# EAGLE schematic porcupine5v1_4 (EAGLE 6.5.0)
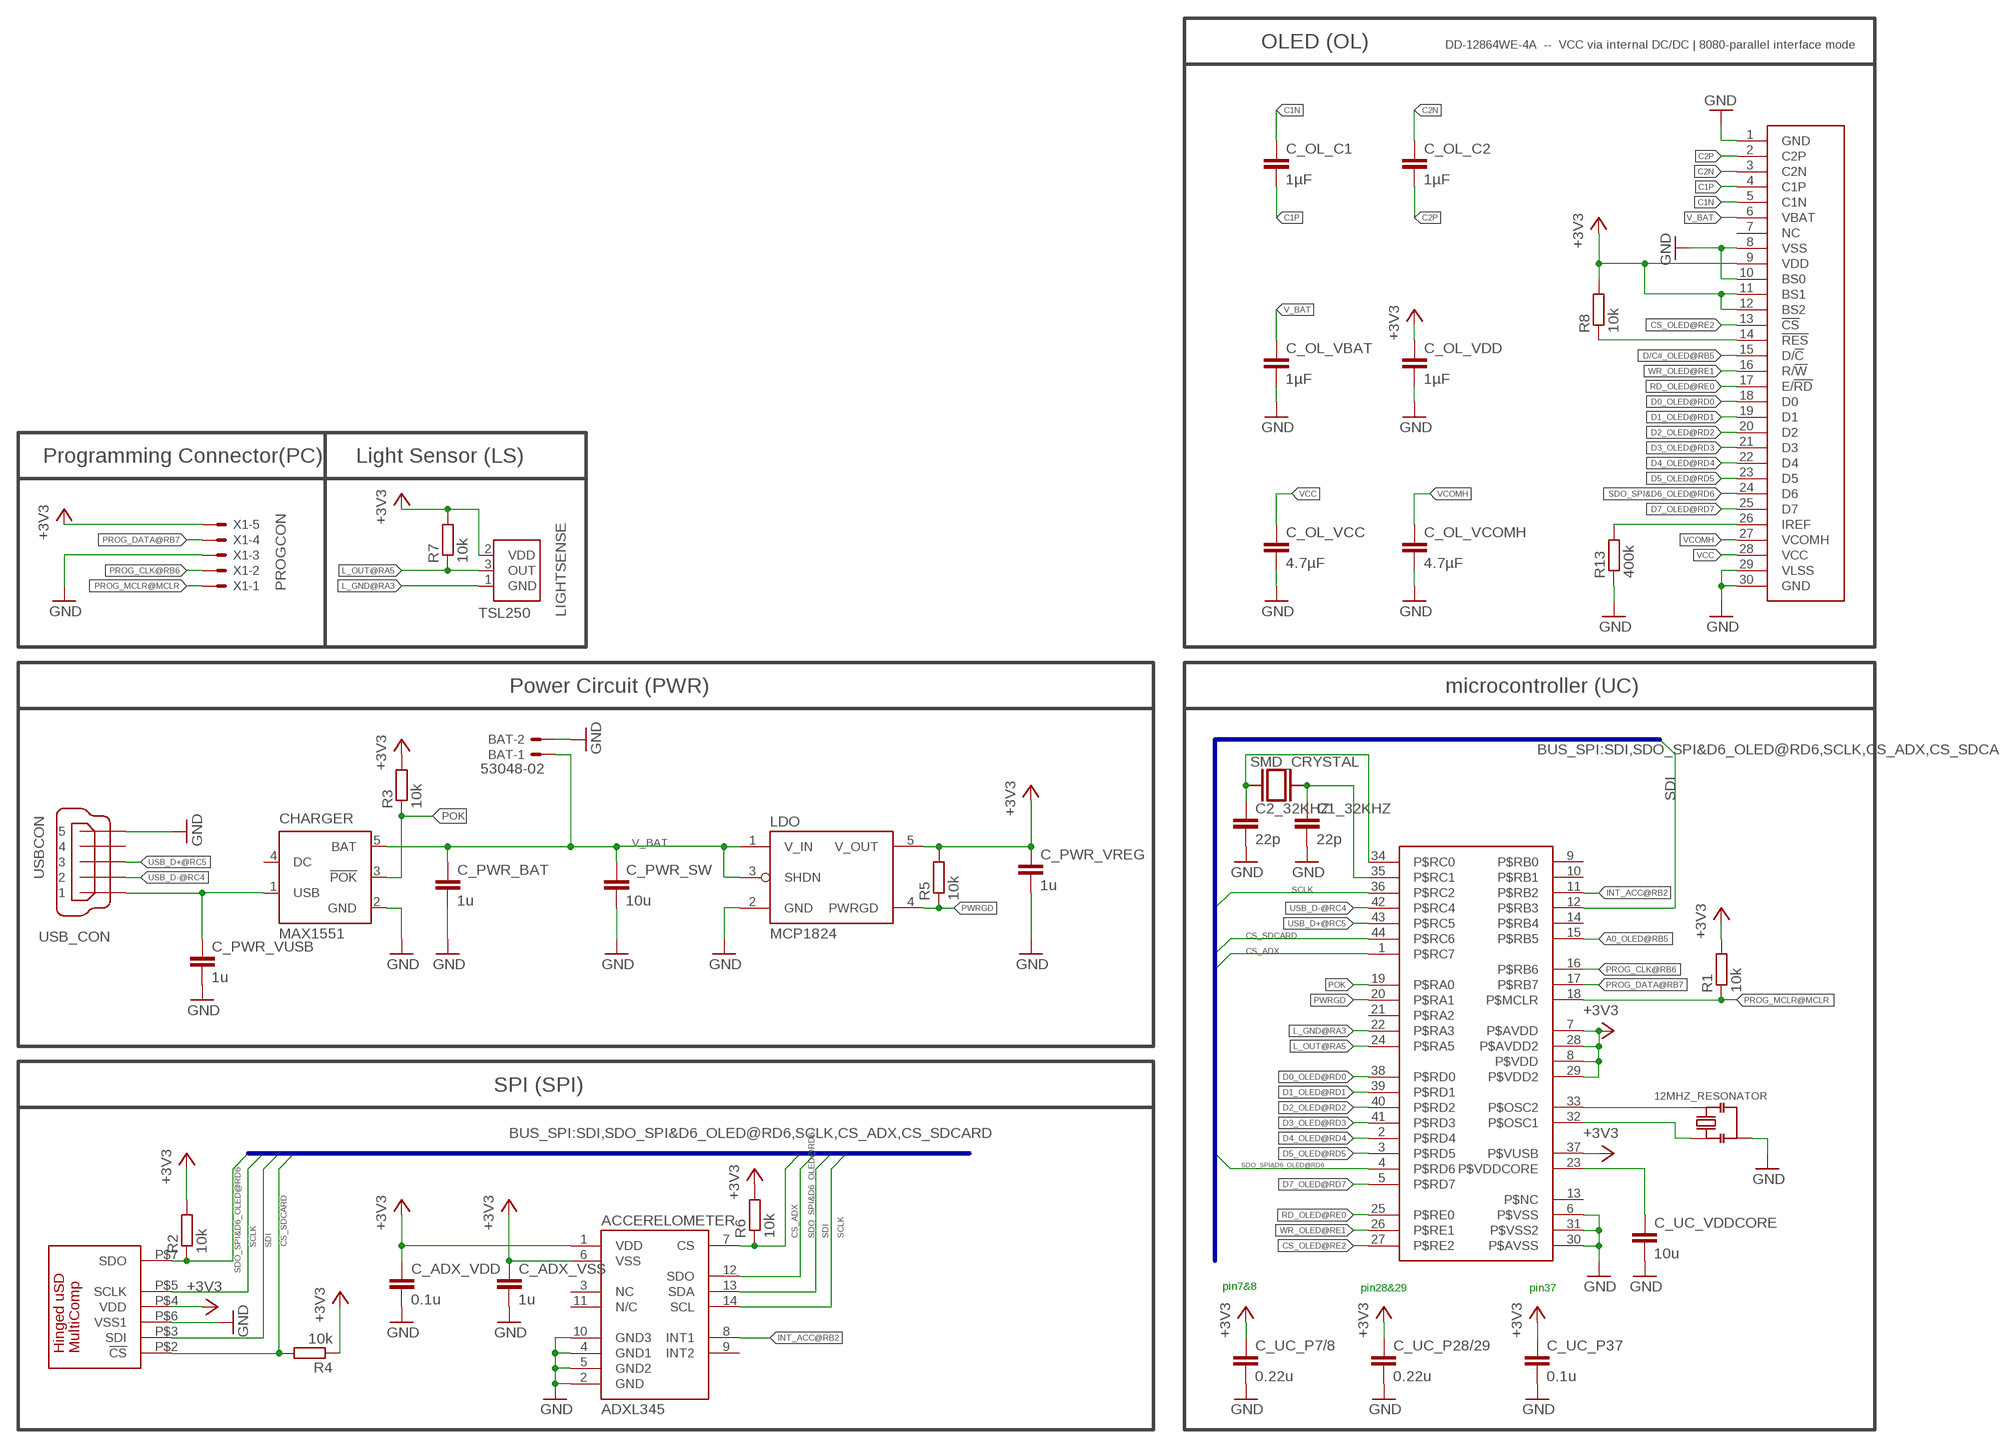
[diagram p0: schematic, sheet 1]

## Parts
12MHZ_RESONATOR  RESONATORPRQC-C  [PRQC-C]
ACCERELOMETER  ADXL345  [LGA14]
BAT  53048-02  [53048-02]
C1_32KHZ  22p  C-EUC0603K  [C0603K]
C2_32KHZ  22p  C-EUC0603K  [C0603K]
C_ADX_VDD  0.1u  C-EUC0603K  [C0603K]
C_ADX_VSS  1u  C-EUC0603K  [C0603K]
C_OL_C1  1µF  C-EUC0603K  [C0603K]
C_OL_C2  1µF  C-EUC0603K  [C0603K]
C_OL_VBAT  1µF  C-EUC0603K  [C0603K]
C_OL_VCC  4.7µF  C-EUC0603K  [C0603K]
C_OL_VCOMH  4.7µF  C-EUC0603K  [C0603K]
C_OL_VDD  1µF  C-EUC0603K  [C0603K]
C_PWR_BAT  1u  C-EUC0603K  [C0603K]
C_PWR_SW  10u  C-EUC0805K  [C0805K]
C_PWR_VREG  1u  C-EUC0603K  [C0603K]
C_PWR_VUSB  1u  C-EUC0603K  [C0603K]
C_UC_P7/8  0.22u  C-EUC0603K  [C0603K]
C_UC_P28/29  0.22u  C-EUC0603K  [C0603K]
C_UC_P37  0.1u  C-EUC0603K  [C0603K]
C_UC_VDDCORE  10u  C-EUC0805K  [C0805K]
CHARGER  MAX1551  [SOT23-5L]
LDO  MCP1824  [SOT-23-5]
LIGHTSENSE  TSL250  [TSL]
PIC_CONTROLLER  PIC_P2V6  [QFN44ML8X8]
R1  10k  R-EU_R0603  [R0603]
R2  10k  R-EU_R0603  [R0603]
R3  10k  R-EU_R0603  [R0603]
R4  10k  R-EU_R0603  [R0603]
R5  10k  R-EU_R0603  [R0603]
R6  10k  R-EU_R0603  [R0603]
R7  10k  R-EU_R0603  [R0603]
R8  10k  R-EU_R0603  [R0603]
R13  400k  R-EU_R0603  [R0603]
SDCARD_CON  MICROSD_CONN  [460DA40013]
SMD_CRYSTAL  SMD_CRYSTAL  [SMD_CRYSTAL]
U$1  DD-12864WE-4A  [CON_DD-12864WE-4A]
USB_CON  USBCON  [248601]
X1  PROGCON  [53047-05-OCT]

## Nets
+3V3: ACCERELOMETER.1(VDD) ACCERELOMETER.6(VSS) C_ADX_VDD.1 C_ADX_VSS.1 C_OL_VDD.1 C_PWR_VREG.1 C_UC_P7/8.1 C_UC_P28/29.1 C_UC_P37.1 LDO.5(V_OUT) LIGHTSENSE.2(VDD) PIC_CONTROLLER.7(P$AVDD) PIC_CONTROLLER.8(P$VDD) PIC_CONTROLLER.28(P$AVDD2) PIC_CONTROLLER.29(P$VDD2) PIC_CONTROLLER.37(P$VUSB) R1.2 R2.2 R3.2 R4.1 R5.2 R6.2 R7.2 R8.2 SDCARD_CON.P$4(VDD) U$1.9(VDD) U$1.11(BS1) U$1.12(BS2) X1.5
A0_OLED@RB5: PIC_CONTROLLER.15(P$RB5)
C1N: C_OL_C1.1 U$1.5(C1N)
C1P: C_OL_C1.2 U$1.4(C1P)
C2N: C_OL_C2.1 U$1.3(C2N)
C2P: C_OL_C2.2 U$1.2(C2P)
CS_ADX: ACCERELOMETER.7(CS) PIC_CONTROLLER.1(P$RC7) R6.1
CS_OLED@RE2: PIC_CONTROLLER.27(P$RE2) U$1.13(!CS)
CS_SDCARD: PIC_CONTROLLER.44(P$RC6) R4.2 SDCARD_CON.P$2(!CS)
D0_OLED@RD0: PIC_CONTROLLER.38(P$RD0) U$1.18(D0)
D1_OLED@RD1: PIC_CONTROLLER.39(P$RD1) U$1.19(D1)
D2_OLED@RD2: PIC_CONTROLLER.40(P$RD2) U$1.20(D2)
D3_OLED@RD3: PIC_CONTROLLER.41(P$RD3) U$1.21(D3)
D4_OLED@RD4: PIC_CONTROLLER.2(P$RD4) U$1.22(D4)
D5_OLED@RD5: PIC_CONTROLLER.3(P$RD5) U$1.23(D5)
D7_OLED@RD7: PIC_CONTROLLER.5(P$RD7) R13.2 U$1.25(D7) U$1.26(IREF)
D/C#_OLED@RB5: U$1.15(D/!C)
GND: 12MHZ_RESONATOR.2_GND(GND) ACCERELOMETER.2(GND) ACCERELOMETER.4(GND1) ACCERELOMETER.5(GND2) ACCERELOMETER.10(GND3) BAT.2 C1_32KHZ.2 C2_32KHZ.2 C_ADX_VDD.2 C_ADX_VSS.2 C_OL_VBAT.2 C_OL_VCC.2 C_OL_VCOMH.2 C_OL_VDD.2 C_PWR_BAT.2 C_PWR_SW.2 C_PWR_VREG.2 C_PWR_VUSB.2 C_UC_P7/8.2 C_UC_P28/29.2 C_UC_P37.2 C_UC_VDDCORE.2 CHARGER.2(GND) LDO.2(GND) PIC_CONTROLLER.6(P$VSS) PIC_CONTROLLER.30(P$AVSS) PIC_CONTROLLER.31(P$VSS2) R13.1 SDCARD_CON.P$6(VSS1) U$1.1(GND) U$1.8(VSS) U$1.10(BS0) U$1.29(VLSS) U$1.30(GND) USB_CON.5 X1.3
INT_ACC@RB2: ACCERELOMETER.8(INT1) PIC_CONTROLLER.11(P$RB2)
L_GND@RA3: LIGHTSENSE.1(GND) PIC_CONTROLLER.22(P$RA3)
L_OUT@RA5: LIGHTSENSE.3(OUT) PIC_CONTROLLER.24(P$RA5) R7.1
N$1: 12MHZ_RESONATOR.1 PIC_CONTROLLER.33(P$OSC2)
N$2: 12MHZ_RESONATOR.3 PIC_CONTROLLER.32(P$OSC1)
N$3: C2_32KHZ.1 PIC_CONTROLLER.34(P$RC0) SMD_CRYSTAL.P$1
N$6: C1_32KHZ.1 PIC_CONTROLLER.35(P$RC1) SMD_CRYSTAL.P$2
POK: CHARGER.3(!POK) PIC_CONTROLLER.19(P$RA0) R3.1
PROG_CLK@RB6: PIC_CONTROLLER.16(P$RB6) X1.2
PROG_DATA@RB7: PIC_CONTROLLER.17(P$RB7) X1.4
PROG_MCLR@MCLR: PIC_CONTROLLER.18(P$MCLR) R1.1 X1.1
PWRGD: LDO.4(PWRGD) PIC_CONTROLLER.20(P$RA1) R5.1
RD_OLED@RE0: PIC_CONTROLLER.25(P$RE0) U$1.17(E/!RD)
RES_OLED: R8.1 U$1.14(!RES)
SCLK: ACCERELOMETER.14(SCL) PIC_CONTROLLER.36(P$RC2) SDCARD_CON.P$5(SCLK)
SDI: ACCERELOMETER.13(SDA) PIC_CONTROLLER.12(P$RB3) SDCARD_CON.P$3(SDI)
SDO_SPI&D6_OLED@RD6: ACCERELOMETER.12(SDO) PIC_CONTROLLER.4(P$RD6) R2.1 SDCARD_CON.P$7(SDO) U$1.24(D6)
USB_D+@RC5: PIC_CONTROLLER.43(P$RC5) USB_CON.3
USB_D-@RC4: PIC_CONTROLLER.42(P$RC4) USB_CON.2
V_BAT: BAT.1 C_OL_VBAT.1 C_PWR_BAT.1 C_PWR_SW.1 CHARGER.5(BAT) LDO.1(V_IN) LDO.3(SHDN) U$1.6(VBAT)
VCC: C_OL_VCC.1 U$1.28(VCC)
VCOMH: C_OL_VCOMH.1 U$1.27(VCOMH)
VDDCORE: C_UC_VDDCORE.1 PIC_CONTROLLER.23(P$VDDCORE)
VUSB: C_PWR_VUSB.1 CHARGER.1(USB) USB_CON.1
WR_OLED@RE1: PIC_CONTROLLER.26(P$RE1) U$1.16(R/!W)
Unconnected: ACCERELOMETER.3(NC) ACCERELOMETER.9(INT2) ACCERELOMETER.11(N/C) CHARGER.4(DC) PIC_CONTROLLER.9(P$RB0) PIC_CONTROLLER.10(P$RB1) PIC_CONTROLLER.13(P$NC) PIC_CONTROLLER.14(P$RB4) PIC_CONTROLLER.21(P$RA2) U$1.7(NC) USB_CON.4

## Buses
BUS_SPI:SDI,SDO_SPI&D6_OLED@RD6,SCLK,CS_ADX,CS_SDCARD

## Notes on the sheet
- OLED (OL) | DD-12864WE-4A  --  VCC via internal DC/DC | 8080-parallel interface mode
- Programming Connector(PC) | Light Sensor (LS)
- Power Circuit (PWR) | microcontroller (UC)
- SPI (SPI)
- pin7&8 | pin28&29 | pin37

## Library data of the parts
12MHZ_RESONATOR = HedgehogLib:RESONATOR
ACCERELOMETER = HedgehogLib:ADXL345
BAT = con-molex:53?-02: CONNECTOR wire to board 1.25 mm (.049 inch) pitch header; MF: MOLEX; MPN: 53048-0210; OC_FARNELL: 1012259; OC_NEWARK: 57H4718
C1_32KHZ C2_32KHZ C_ADX_VDD C_ADX_VSS C_OL_C1 C_OL_C2 C_OL_VBAT C_OL_VCC C_OL_VCOMH C_OL_VDD C_PWR_BAT C_PWR_SW C_PWR_VREG C_PWR_VUSB C_UC_P7/8 C_UC_P28/29 C_UC_P37 C_UC_VDDCORE = rcl:C-EU: CAPACITOR, European symbol
CHARGER = maxim:MAX1551: Dual-Input USB/AC Adapter 1-Cell Li+ Battery Chargers Source: http://www.maxim-ic.com .. MAX1551-MAX1555.pdf
LDO = HedgehogLib:MCP1824: MCP1824T-3302E/OT http://de.farnell.com/1578387
LIGHTSENSE = HedgehogLib:TSL250
PIC_CONTROLLER = HedgehogLib:PIC_P2V6
R1-R8 R13 = rcl:R-EU_: RESISTOR, European symbol
SDCARD_CON = HedgehogLib:MICROSD_CONN
SMD_CRYSTAL = HedgehogLib:SMD_CRYSTAL
U$1 = HedgehogLib:DD-12864WE-4A
USB_CON = HedgehogLib:USBCON: MINI USB 2.0 Connector TypeB
X1 = HedgehogLib:PROGCON: Programmer Connector wire to board 1.25 mm (.049 inch) pitch header